# Altium schematic sheet RTC.SchDoc
size A3; PageSetup: Record=PageOptions|CenterHorizontal=True|CenterVertical=True|PrintScale=0.73|XCorrection=1.00|YCorrection=1.00|PrintKind=0|BorderSize=5000000|LeftOffset=0|BottomOffset=0|Orientation=2|PaperLength=1000|PaperWidth=1000|Scale=100|PaperSource=7|PrintQuality=-4|MediaType=1|DitherType=10|PaperKind=A4|PrintScaleMode=1; Date: 27.05.2014; DrawnBy: luths8; Organization: BFH; Address1: Bern University of Applied Sciences; Address2: Engineering and Information Technology; Address3: Jlcoweg 1; Address4: CH-3400 Burgdorf; DocumentNumber: 4; Revision: 1.0; SheetNumber: 4; SheetTotal: 16; CurrentDate: 27.05.2014
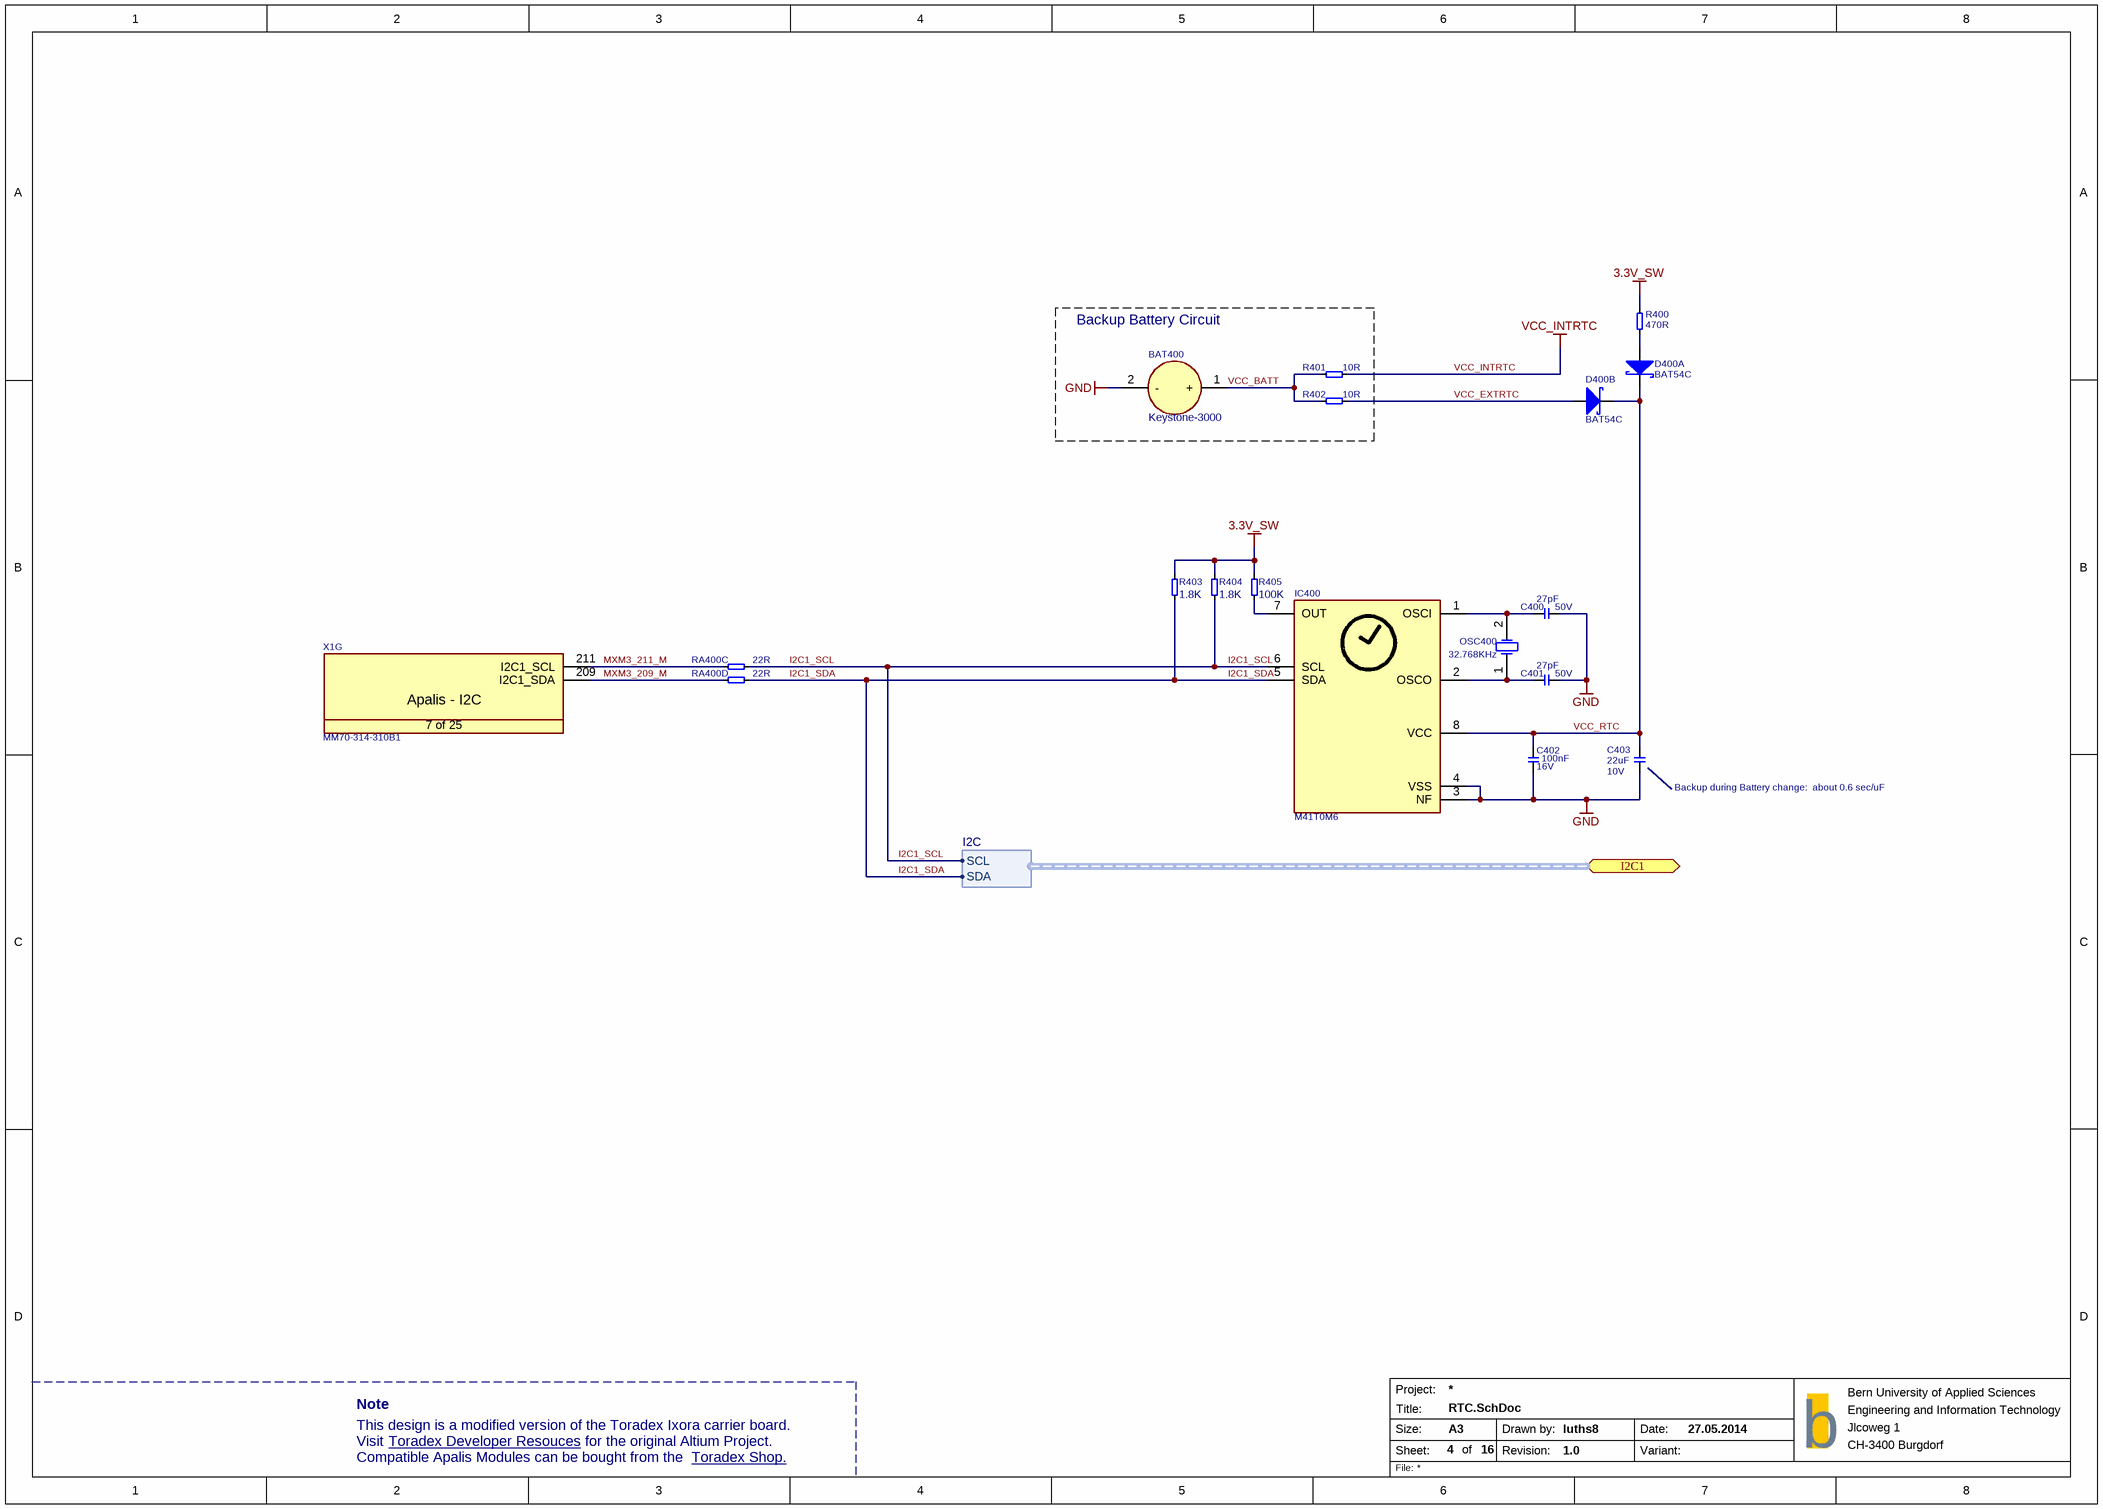
[diagram p0: RTC.SchDoc]

## Parts
BAT400  Keystone-3000  [T_Keystone_3000]
C400  Rating: 50V  [SMD0603CAP]  (hidden comment: 27pF)
C401  Rating: 50V  [SMD0603CAP]  (hidden comment: 27pF)
C402  Rating: 16V  [SMD0603CAP]  (hidden comment: 100nF)
C403  Rating: 10V  [SMD0805CAP]  (hidden comment: 22uF)
D400  BAT54C  [SOT95P230X110-3N]  (parts A,B of 2)
IC400  M41T0M6  [SOIC127P600X173-8N]
OSC400  value 32.768KHz  [T_MC_CC4V-T1A]  (hidden comment: CC4V-T1A)
R400  470R  [SMD0603RES]
R401  10R  [SMD0603RES]
R402  10R  [SMD0603RES]
R403  1.8K  [SMD0603RES]
R404  1.8K  [SMD0603RES]
R405  100K  [SMD0603RES]
RA400  22R  [T_Resistor_Array_X4]  (parts C,D of 4)
X1  Manufacturer Part No.: MM70-314-310B1  [T_JAE_MM70-314-310B1]  (hidden comment: CON-JAE-MM70-314-310B1-314-0.5mm)  (part G of 25)

## Blocks framed on the sheet
Backup Battery Circuit: BAT400 R401 R402

## Ports
I2C1 (bidir, harness I2C, see 12, 17, 18, 19)

## Harnesses
I2C: SCL, SDA

## Nets
3.3V_SW: R400.2 R403.2 R404.2 R405.2
GND: BAT400.2(-) C400.2 C401.2 C402.1 C403.2 IC400.3(NF) IC400.4(VSS)
VCC_INTRTC: R401.2
I2C1_SCL: IC400.6(SCL) R404.1 RA400.7 ; port I2C1.SCL
I2C1_SDA: IC400.5(SDA) R403.1 RA400.8 ; port I2C1.SDA
MXM3_209_M: RA400.4 X1.209(I2C1_SDA)
MXM3_211_M: RA400.3 X1.211(I2C1_SCL)
VCC_BATT: BAT400.1(+) R401.1 R402.1
VCC_EXTRTC: D400.2 R402.2
VCC_RTC: C402.2 C403.1 D400.3 IC400.8(VCC)
NetC400_1: C400.1 IC400.1(OSCI) OSC400.2(OSC2)
NetC401_1: C401.1 IC400.2(OSCO) OSC400.1(OSC1)
NetD400_1: D400.1 R400.1
NetIC400_7: IC400.7(OUT) R405.1

## Notes on the sheet
- (near C403) Backup during Battery change:  about 0.6 sec/uF
- Note
- This design is a modified version of the Toradex Ixora carrier board.
- Visit
- Compatible Apalis Modules can be bought from the
- Toradex Developer Resouces <https://developer.toradex.com/products/ixora-carrier-board>
- for the original Altium Project.
- Toradex Shop. <https://www.toradex.com/order-now/apalis-arm-family>
- Project:
- Size:
- Sheet:
- Title:
- A3
- of
- Drawn by:
- Revision:
- Date:
- Variant:
- b
- File:
- (in symbol CON-JAE-MM70-314-310B1-314-0.5mm, part G) Apalis - I2C; 7 of 25

## Library data of the parts
BAT400 = BAT-Keystone-3000: Battery Holder; Manufacturer Part No.: 3000; Manufacturer Name: Keystone
C400 C401 = C-NPO-27pF-50V-5%-0603: Capacitor Ceramic NPO 27pF 50V 5% 0603; Tolerance: 5%; Type: NPO; Value: 27pF
C402 = C-X7R-100nF-16V-10%-0402: Capacitor Ceramic X7R 100nF 16V 10% 0603; Tolerance: 10%; Type: X7R; Value: 100nF
C403 = C-X5R-22uF-10V-20%-0805: Capacitor Ceramic X5R 22uF 10V 20% 0805; Tolerance: 20%; Type: X5R; Value: 22uF
D400 = D-Philips-BAT54C-Schottky-30V-200mA: BAT54 Schottky Diode; Manufacturer: Philips; Manufacturer Part No.: BAT54C
IC400 = IC-ST-M41T0M6: RTC M41T0M6; Manufacturer Name: ST; Manufacturer Part No.: M41T0M6
OSC400 = OSC-MC-CC4V-T1A-32.768KHz-30ppm-5x1.9mm: Quartz 32.768kHz; Manufacturer Name: Micro Crystal; Tolerance: 30ppm; Manufacturer Part No.: CC4V-T1A
R400 = R-470R-63mW-5%-0402: Resistor 470 ohm 63mW 5% 0603; Rating: 63mW; Tolerance: 5%; Value: 470R
R401 R402 = R-10R-63mW-5%-0603: Resistor 10 ohm 63mW 5% 0603; Rating: 63mW; Tolerance: 5%; Value: 10R
R403 R404 = R-1.8KR-63mW-5%-0402: Resistor 1.8 Kohm 63mW 5% 0603; Value: 1.8KR; Rating: 63mW; Tolerance: 5%
R405 = R-100KR-63mW-5%-0402: Resistor 100 Kohm 63mW 5% 0603; Value: 100KR; Rating: 63mW; Tolerance: 5%
RA400 = RA-22R-63mW-5%-1206-div: Resistor Array 22 R 63mW 5% 1206; Tolerance: 5%; Power Dissipation: 63mW; Value: 22R
X1 = CON-JAE-MM70-314-310B1-314-0.5mm: MXM3 Connector; Manufacturer Name: JAE; No. of ways: 314